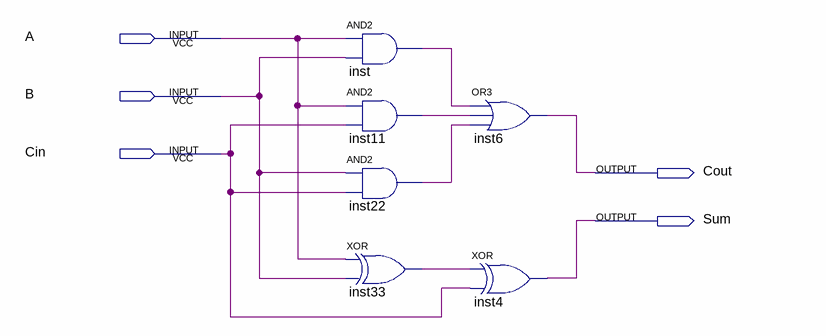
[diagram p0: schematic sheet]
// Quartus schematic sum.bdf as structural Verilog: 6 symbols, 5 pins
module sum (
  input  A,
  input  B,
  input  Cin,
  output Cout,
  output Sum
);

  wire inst11_out, inst22_out, inst33_out, inst_out;

  and inst (inst_out, A, B);
  and inst11 (inst11_out, A, Cin);
  and inst22 (inst22_out, B, Cin);
  xor inst33 (inst33_out, A, B);
  or inst6 (Cout, inst_out, inst11_out, inst22_out);
  xor inst4 (Sum, inst33_out, Cin);
endmodule
